# Altium project Multiplexer_SWD.PrjPCB (part 1 of 2)
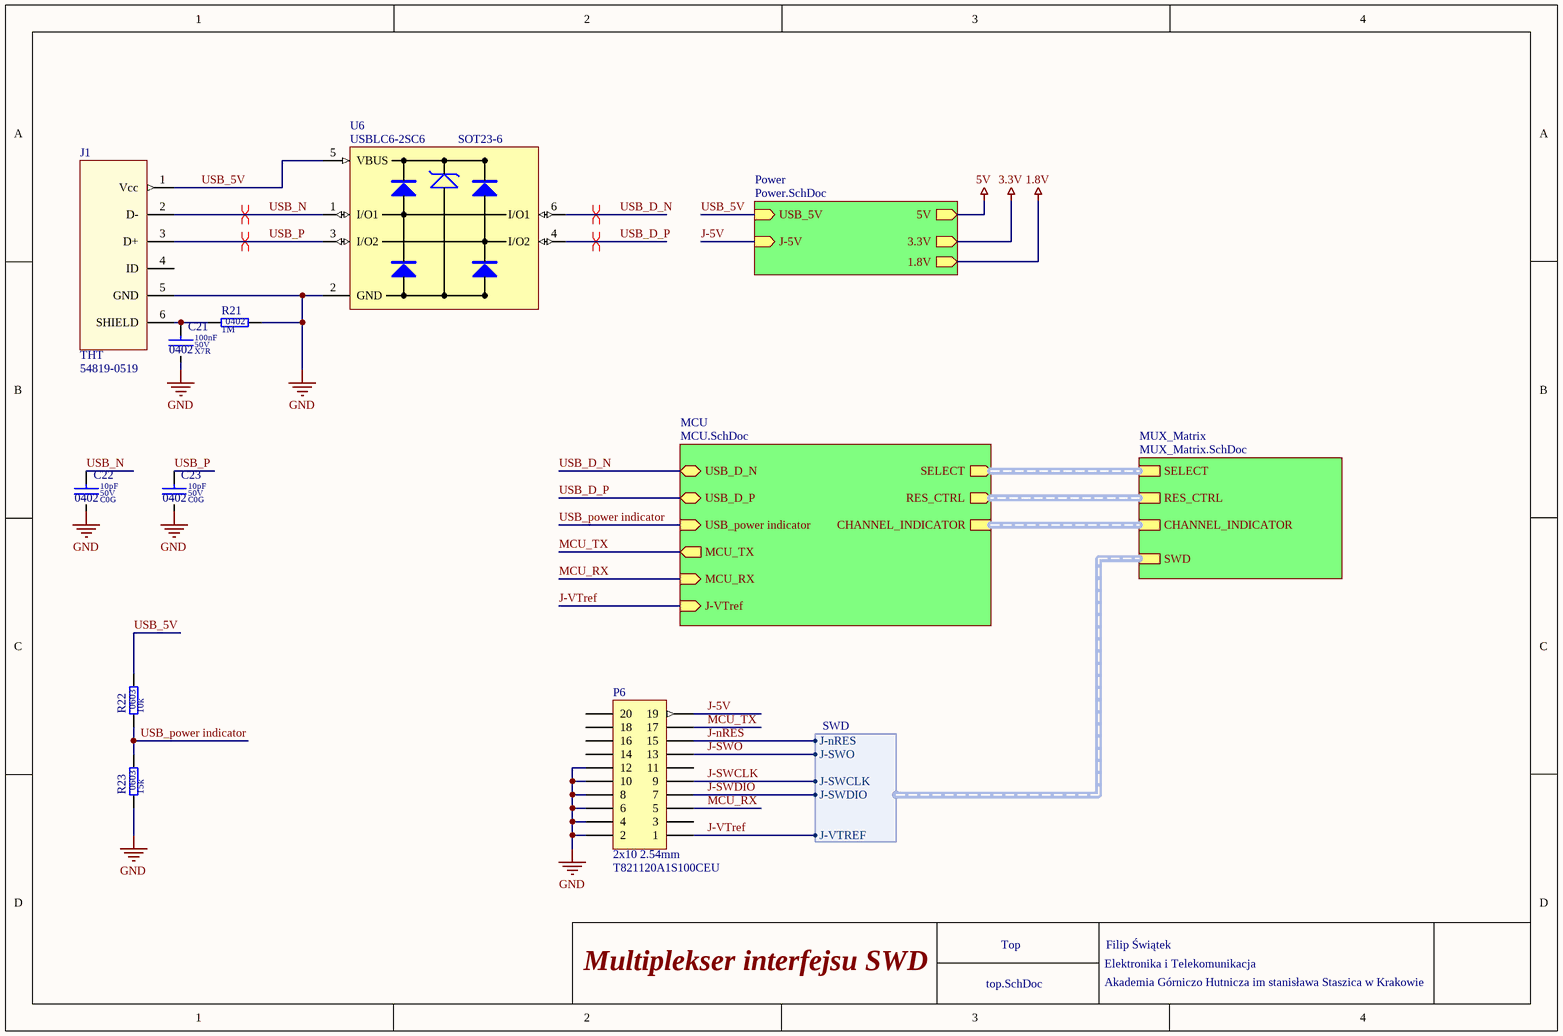
[diagram p0: top.SchDoc]
title: Multipkekser interfejsu SWD - Praca Inzynierska
7 sheets, 123 parts. Net scope: hierarchical (ports join the sheet entries above them; power ports are global).
Board file: PCB.PcbDoc
Sheets:
  top.SchDoc
    MCU = MCU.SchDoc
      U_TXS0102YZPR = TXS0102YZPR.SchDoc
      U_TXS0102YZPR = TXS0102YZPR.SchDoc
    MUX_Matrix = MUX_Matrix.SchDoc
      nRes_MUX = MUX.SchDoc
      SWO_MUX = MUX.SchDoc
      SWCLK_MUX = MUX.SchDoc
      SWDIO_MUX = MUX.SchDoc
      VTREF_MUX = MUX.SchDoc
      target_connectors_CH0 = target_connectors.SchDoc
      target_connectors_CH1 = target_connectors.SchDoc
      target_connectors_CH2 = target_connectors.SchDoc
      target_connectors_CH3 = target_connectors.SchDoc
      target_connectors_CH4 = target_connectors.SchDoc
      target_connectors_CH5 = target_connectors.SchDoc
      target_connectors_CH6 = target_connectors.SchDoc
      target_connectors_CH7 = target_connectors.SchDoc
    Power = Power.SchDoc

## Sheet top.SchDoc: Multiplekser interfejsu SWD
size A4; Module: Top; Organization: Altium Limited; Address1: L3, 12a Rodborough Rd; Adress2: Frenchs Forest; Address3: NSW; Address4: Australia 2086; SheetNumber: 1

### Parts
C21  value 100nF  Dielectric: X7R  Voltage: 50V  SCH_Footprint: 0402  [C_0402_1005]  (hidden comment: Ceramic X7R)
C22  value 10pF  Dielectric: C0G  Voltage: 50V  SCH_Footprint: 0402  [C_0402_1005]  (hidden comment: Ceramic C0G)
C23  value 10pF  Dielectric: C0G  Voltage: 50V  SCH_Footprint: 0402  [C_0402_1005]  (hidden comment: Ceramic C0G)
J1  value 54819-0519  SCH_Footprint: THT  [J_USB_MINIB_54819-0519_THT]  (hidden comment: USB connector)
P6  value T821120A1S100CEU  SCH_Footprint: 2x10 2.54mm  [P_IDC_2x10_2.54]  (hidden comment: 2x10 IDC 2.54mm shrouded)
R21  value 1M  SCH_Footprint: 0402  [R_0402_1005]  (hidden comment: Resistor)
R22  value 10k  SCH_Footprint: 0603  [R_0603_1608]  (hidden comment: Resistor)
R23  value 15k  SCH_Footprint: 0603  [R_0603_1608]  (hidden comment: Resistor)
U6  value USBLC6-2SC6  SCH_Footprint: SOT23-6  [SOT23-6_SC74A_SOT753]  (hidden comment: USB 2.0/1.1, Ethernet and SIM card ESD protection)

### Sub-sheets
MCU = MCU.SchDoc: USB_D_N (bidir), USB_D_P (bidir), USB_power indicator (in), SELECT (out, harness SELECT), MCU_TX (out), MCU_RX (in), J-VTref (in), RES_CTRL (out, harness RES_CTRL), CHANNEL_INDICATOR (harness CHANNEL_INDICATOR)
MUX_Matrix = MUX_Matrix.SchDoc: SWD (harness SWD), SELECT (harness SELECT), RES_CTRL (harness RES_CTRL), CHANNEL_INDICATOR (harness CHANNEL_INDICATOR)
Power = Power.SchDoc: J-5V (in), USB_5V (in), 5V (out), 3.3V (out), 1.8V (out)

### Harnesses
SWD: J-nRES, J-SWO, J-SWCLK, J-SWDIO, J-VTREF

### Nets
GND: C21.2 C22.2 C23.2 J1.5(GND) P6.2 P6.4 P6.6 P6.8 P6.10 P6.12 R21.2 R23.1 U6.2(GND)
J-5V: P6.19 ; sheet Power/J-5V
J-nRES: P6.15 ; sheet MUX_Matrix/SWD.J-nRES
J-SWCLK: P6.9 ; sheet MUX_Matrix/SWD.J-SWCLK
J-SWDIO: P6.7 ; sheet MUX_Matrix/SWD.J-SWDIO
J-SWO: P6.13 ; sheet MUX_Matrix/SWD.J-SWO
J-VTref: P6.1 ; sheet MCU/J-VTref, sheet MUX_Matrix/SWD.J-VTREF
MCU_RX: P6.5 ; sheet MCU/MCU_RX
MCU_TX: P6.17 ; sheet MCU/MCU_TX
USB_5V: J1.1(Vcc) R22.2 U6.5(VBUS) ; sheet Power/USB_5V
USB_D_N: U6.6(I/O1) ; sheet MCU/USB_D_N
USB_D_P: U6.4(I/O2) ; sheet MCU/USB_D_P
USB_N: C22.1 J1.2(D-) U6.1(I/O1)
USB_P: C23.1 J1.3(D+) U6.3(I/O2)
USB_power indicator: R22.1 R23.2 ; sheet MCU/USB_power indicator
NetC21_1: C21.1 J1.6(SHIELD) R21.1

Not connected (* = marked no-connect by the designer): J1 4(ID); P6 3 11 14 16 18 20

### Buses and harness runs
harness sheet MCU/CHANNEL_INDICATOR = sheet MUX_Matrix/CHANNEL_INDICATOR
harness sheet MCU/RES_CTRL = sheet MUX_Matrix/RES_CTRL
harness sheet MCU/SELECT = sheet MUX_Matrix/SELECT

### Layout directives
differential pair: USB_D_N, USB_D_P, USB_N, USB_P

### Notes on the sheet
- Elektronika i Telekomunikacja
- Akademia Górniczo Hutnicza im stanisława Staszica w Krakowie
- Filip Świątek

### Library data of the parts
C21 = C_100nF_50V_X7R_0402_10: Capacitor; Manufacturer: Murata; Manufacturer Part Number: GRM155R71H104KE14D; Tolerance (%): 10; Part Number: C_100nF_50V_X7R_0402_10; HelpURL: http://docs-europe.electrocomponents.com/webdocs/145f/0900766b8145f9d2.pdf; Supplier 1: TME; Supplier Part Number 1: GRM155R71H104KE14D; Supplier 2: RS Components; Supplier Part Number 2: 8847087; Supplier 3: Farnell; Supplier Part Number 3: 2611912; Supplier 4: Mouser; Supplier Part Number 4: 81-GRM155R71H104KE4D; Supplier 5: Digi-Key; Supplier Part Number 5: 490-10700-1-ND
C22 C23 = C_10pF_50V_C0G_0402_5: Capacitor; Manufacturer: Murata; Manufacturer Part Number: GRM1555C1H100JA01D; Tolerance (%): 5; Part Number: C_10pF_50V_C0G_0402_5; HelpURL: https://www.mouser.com/ds/2/281/c02e-2905.pdf; Supplier 1: TME; Supplier 2: RS Components; Supplier 3: Farnell; Supplier 4: Mouser; Supplier Part Number 4: 81-GRM1555C1H100JA1D; Supplier 5: Digi-Key
J1 = J_USB_MINIB_54819-0519: Złącze USB, Mini USB typu B, USB 2.0 OTG, Montaż przewlekany; Manufacturer: Molex; Part Number: J_USB_MINIB_54819-0519; Component Type: Standard; HelpURL: http://www.molex.com/pdm_docs/sd/548190519_sd.pdf; Manufacturer Part Number: 54819-0519; Supplier 1: TME; Supplier Part Number 1: MX-54819-0519; Supplier 2: RS Components; Supplier Part Number 2: 5152005P; Supplier 3: Farnell; Supplier Part Number 3: 9786465; Supplier 4: Mouser; Supplier Part Number 4: 538-54819-0519; Supplier 5: Digi-Key
P6 = P_IDC_2x10_2.54: Header, 20-Pin; Manufacturer: Amphenol; Part Number: P_IDC_2x10_2.54; Component Type: Standard; HelpURL: https://datasheet.octopart.com/T821120A1S100CEU-Amphenol-datasheet-12110023.pdf; Manufacturer Part Number: T821120A1S100CEU; Supplier 1: TME; Supplier Part Number 1: T821-1-20-S1; Supplier 2: RS Components; Supplier Part Number 2: 832-3499; Supplier 3: Farnell; Supplier Part Number 3: 2215309; Supplier 4: Mouser; Supplier 5: Digi-Key
R21 = R_1M_0402_1: Manufacturer: Vishay; Manufacturer Part Number: CRCW04021M00FKED; Voltage: 50V; Power: 200mW; Tolerance: 1%; Part Number: R_1M_0402_1; HelpURL: http://datasheet.octopart.com/CRCW04021M00FKED.-Vishay-datasheet-78776209.pdf; Supplier 1: TME; Supplier 2: RS Components; Supplier Part Number 2: 6788923; Supplier 3: Farnell; Supplier Part Number 3: 1469667; Supplier 4: Mouser; Supplier Part Number 4: 71-CRCW0402-1.0M-E3; Supplier 5: Digi-Key; Supplier Part Number 5: 541-1.00MLCT-ND
R22 = R_10k_0603_1: Manufacturer: Vishay; Manufacturer Part Number: CRCW060310K0FKTABC; Voltage: 75V; Power: 100mW; Tolerance: 1%; Part Number: R_10k_0603_1; HelpURL: http://www.tme.eu/pl/Document/622e28308c06d160637f2b14751ba16b/Data%20Sheet%20CRCW_BCe3.pdf; Supplier 1: TME; Supplier Part Number 1: CRCW060310K0FKTABC; Supplier 2: RS Components; Supplier 3: Farnell; Supplier 4: Mouser; Supplier Part Number 4: 667-ERJ-3EKF1002V; Supplier 5: Digi-Key; Supplier Part Number 5: P10KGCT-ND
R23 = R_15k_0603_1: Manufacturer: Yageo; Manufacturer Part Number: RC0603FR-0715KL; Voltage: 50V; Power: 100mW; Tolerance: 1%; Part Number: R_15k_0603_1; HelpURL: http://www.tme.eu/pl/Document/d2a72e545e5c8eb7bf2a04fa97535928/rc0603yageo.pdf; Supplier 1: TME; Supplier Part Number 1: RC0603FR-0715K; Supplier 2: RS Components; Supplier 3: Farnell; Supplier Part Number 3: 2413677; Supplier 4: Mouser; Supplier Part Number 4: 603-RC0603FR-0715KL; Supplier 5: Digi-Key; Supplier Part Number 5: 311-15.0KHRCT-ND
U6 = U_USBLC6-2SC6: Manufacturer: STMicroelectronics; Part Number: U_USBLC6-2SC6; HelpURL: https://www.st.com/resource/en/datasheet/usblc6-2.pdf; Manufacturer Part Number: USBLC6-2SC6; Supplier 1: TME; Supplier Part Number 1: USBLC6-2SC6; Supplier 2: RS Components; Supplier Part Number 2: 624-7693; Supplier 3: Farnell; Supplier Part Number 3: 2473979; Supplier 4: Mouser; Supplier Part Number 4: 511-USBLC6-2SC6; Supplier 5: Digi-Key; Supplier Part Number 5: 497-5235-1-ND

## Sheet MCU.SchDoc: Multiplekser interfejsu SWD
size A4; Organization: Altium Limited; Address1: L3, 12a Rodborough Rd; Adress2: Frenchs Forest; Address3: NSW; Address4: Australia 2086; SheetNumber: 2
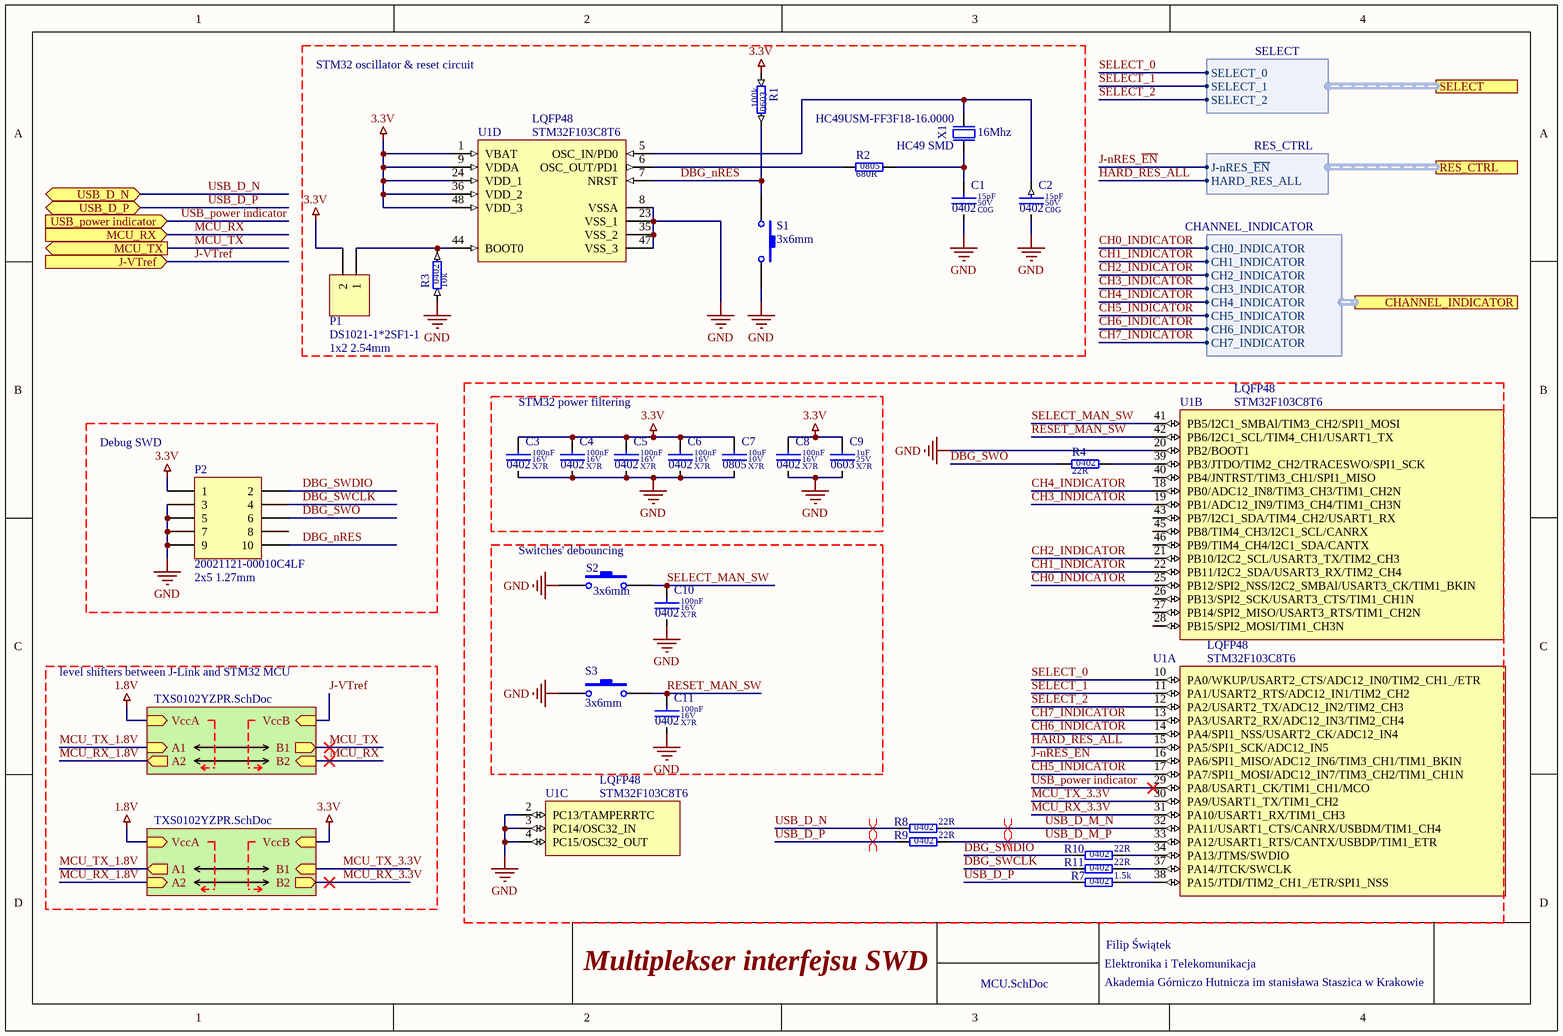
[diagram p1: MCU.SchDoc]

### Parts
C1  value 15pF  Dielectric: C0G  Voltage: 50V  SCH_Footprint: 0402  [C_0402_1005]  (hidden comment: Ceramic C0G)
C2  value 15pF  Dielectric: C0G  Voltage: 50V  SCH_Footprint: 0402  [C_0402_1005]  (hidden comment: Ceramic C0G)
C3  value 100nF  Dielectric: X7R  Voltage: 16V  SCH_Footprint: 0402  [C_0402_1005]  (hidden comment: Ceramic X7R)
C4  value 100nF  Dielectric: X7R  Voltage: 16V  SCH_Footprint: 0402  [C_0402_1005]  (hidden comment: Ceramic X7R)
C5  value 100nF  Dielectric: X7R  Voltage: 16V  SCH_Footprint: 0402  [C_0402_1005]  (hidden comment: Ceramic X7R)
C6  value 100nF  Dielectric: X7R  Voltage: 16V  SCH_Footprint: 0402  [C_0402_1005]  (hidden comment: Ceramic X7R)
C7  value 10uF  Dielectric: X7R  Voltage: 10V  SCH_Footprint: 0805  [C_0805_2012]  (hidden comment: Ceramic X7R)
C8  value 100nF  Dielectric: X7R  Voltage: 16V  SCH_Footprint: 0402  [C_0402_1005]  (hidden comment: Ceramic X7R)
C9  value 1uF  Dielectric: X7R  Voltage: 25V  SCH_Footprint: 0603  [C_0603_1608]  (hidden comment: Ceramic X7R)
C10  value 100nF  Dielectric: X7R  Voltage: 16V  SCH_Footprint: 0402  [C_0402_1005]  (hidden comment: Ceramic X7R)
C11  value 100nF  Dielectric: X7R  Voltage: 16V  SCH_Footprint: 0402  [C_0402_1005]  (hidden comment: Ceramic X7R)
P1  value DS1021-1*2SF1-1  SCH_Footprint: 1x2 2.54mm  [P_HEADER_1x2_2.54]  (hidden comment: Goldpin)
P2  value 20021121-00010C4LF  SCH_Footprint: 2x5 1.27mm  [P_HEADER_2x5_1.27]  (hidden comment: Jtag)
R1  value 100k  SCH_Footprint: 0603  [R_0603_1608]  (hidden comment: Resistor)
R2  value 680R  SCH_Footprint: 0805  [R_0805_2012]  (hidden comment: Resistor)
R3  value 10k  SCH_Footprint: 0402  [R_0402_1005]  (hidden comment: Resistor)
R4  value 22R  SCH_Footprint: 0402  [R_0402_1005]  (hidden comment: Resistor)
R7  value 1.5k  SCH_Footprint: 0402  [R_NC_0402_1005]  (hidden comment: Resistor)
R8  value 22R  SCH_Footprint: 0402  [R_0402_1005]  (hidden comment: Resistor)
R9  value 22R  SCH_Footprint: 0402  [R_0402_1005]  (hidden comment: Resistor)
R10  value 22R  SCH_Footprint: 0402  [R_0402_1005]  (hidden comment: Resistor)
R11  value 22R  SCH_Footprint: 0402  [R_0402_1005]  (hidden comment: Resistor)
S1  3x6mm  [S_TACTSWITCH3x6]
S2  3x6mm  [S_TACTSWITCH3x6]
S3  3x6mm  [S_TACTSWITCH3x6]
U1  SCH_Footprint: LQFP48  [LQFP48_7x7]  (hidden comment: STM32F103C8T6)  (parts A,B,C,D of 4)
X1  value 16Mhz  Manufacturer Part Number: HC49USM-FF3F18-16.0000  SCH_Footprint: HC49 SMD  [X_HC49_SMD]  (hidden comment: *)

### Blocks framed on the sheet
STM32 oscillator & reset circuit: C1 C2 P1 R1-R3 S1 U1 X1
STM32 power filtering: C3-C9
Debug SWD: P2
Switches' debouncing: C10 C11 S2 S3

### Sub-sheets
U_TXS0102YZPR = TXS0102YZPR.SchDoc: A1 (in), A2 (out), B1 (out), B2 (in), VccB (in), VccA (in)
U_TXS0102YZPR = TXS0102YZPR.SchDoc: A1 (out), A2 (in), B1 (in), B2 (out), VccB (in), VccA (in)

### Ports
CHANNEL_INDICATOR (harness CHANNEL_INDICATOR), J-VTref (in), MCU_RX (in), MCU_TX (out), RES_CTRL (harness RES_CTRL), SELECT (harness SELECT), USB_D_N (bidir), USB_D_P (bidir), USB_power indicator (in)

### Harnesses
SELECT: SELECT_0, SELECT_1, SELECT_2
RES_CTRL: HARD_RES_ALL, J-nRES_~{EN}
CHANNEL_INDICATOR: CH1_INDICATOR, CH2_INDICATOR, CH3_INDICATOR, CH4_INDICATOR, CH5_INDICATOR, CH6_INDICATOR, CH7_INDICATOR, CH0_INDICATOR

### Nets
1.8V: sheet U_TXS0102YZPR/VccA, sheet U_TXS0102YZPR/VccA
3.3V: C3.1 C4.1 C5.1 C6.1 C7.1 C8.1 C9.1 P1.2 P2.1 R1.1 U1.1(VBAT) U1.9(VDDA) U1.24(VDD_1) U1.36(VDD_2) U1.48(VDD_3) ; sheet U_TXS0102YZPR/VccB
GND: C1.2 C2.2 C3.2 C4.2 C5.2 C6.2 C7.2 C8.2 C9.2 C10.2 C11.2 P2.3 P2.5 P2.7 P2.9 R3.1 S1.2 S2.1 S3.1 U1.2(PC13/TAMPERRTC) U1.3(PC14/OSC32_IN) U1.4(PC15/OSC32_OUT) U1.8(VSSA) U1.20(PB2/BOOT1) U1.23(VSS_1) U1.35(VSS_2) U1.47(VSS_3)
CH0_INDICATOR: U1.25(PB12/SPI2_NSS/I2C2_SMBAl/USART3_CK/TIM1_BKIN) ; port CHANNEL_INDICATOR.CH0_INDICATOR
CH1_INDICATOR: U1.22(PB11/I2C2_SDA/USART3_RX/TIM2_CH4) ; port CHANNEL_INDICATOR.CH1_INDICATOR
CH2_INDICATOR: U1.21(PB10/I2C2_SCL/USART3_TX/TIM2_CH3) ; port CHANNEL_INDICATOR.CH2_INDICATOR
CH3_INDICATOR: U1.19(PB1/ADC12_IN9/TIM3_CH4/TIM1_CH3N) ; port CHANNEL_INDICATOR.CH3_INDICATOR
CH4_INDICATOR: U1.18(PB0/ADC12_IN8/TIM3_CH3/TIM1_CH2N) ; port CHANNEL_INDICATOR.CH4_INDICATOR
CH5_INDICATOR: U1.17(PA7/SPI1_MOSI/ADC12_IN7/TIM3_CH2/TIM1_CH1N) ; port CHANNEL_INDICATOR.CH5_INDICATOR
CH6_INDICATOR: U1.14(PA4/SPI1_NSS/USART2_CK/ADC12_IN4) ; port CHANNEL_INDICATOR.CH6_INDICATOR
CH7_INDICATOR: U1.13(PA3/USART2_RX/ADC12_IN3/TIM2_CH4) ; port CHANNEL_INDICATOR.CH7_INDICATOR
DBG_nRES: P2.10 R1.2 S1.1 U1.7(NRST)
DBG_SWCLK: P2.4 R11.1
DBG_SWDIO: P2.2 R10.1
DBG_SWO: P2.6 R4.1
HARD_RES_ALL: U1.15(PA5/SPI1_SCK/ADC12_IN5) ; port RES_CTRL.HARD_RES_ALL
J-nRES_~{EN}: U1.16(PA6/SPI1_MISO/ADC12_IN6/TIM3_CH1/TIM1_BKIN) ; port RES_CTRL.J-nRES_~{EN}
J-VTref: port J-VTref, sheet U_TXS0102YZPR/VccB
MCU_RX: port MCU_RX, sheet U_TXS0102YZPR/B2
MCU_RX_1.8V: sheet U_TXS0102YZPR/A2, sheet U_TXS0102YZPR/A2
MCU_RX_3.3V: U1.31(PA10/USART1_RX/TIM1_CH3) ; sheet U_TXS0102YZPR/B2
MCU_TX: port MCU_TX, sheet U_TXS0102YZPR/B1
MCU_TX_1.8V: sheet U_TXS0102YZPR/A1, sheet U_TXS0102YZPR/A1
MCU_TX_3.3V: U1.30(PA9/USART1_TX/TIM1_CH2) ; sheet U_TXS0102YZPR/B1
RESET_MAN_SW: C11.1 S3.2 U1.42(PB6/I2C1_SCL/TIM4_CH1/USART1_TX)
SELECT_0: U1.10(PA0/WKUP/USART2_CTS/ADC12_IN0/TIM2_CH1_/ETR) ; port SELECT.SELECT_0
SELECT_1: U1.11(PA1/USART2_RTS/ADC12_IN1/TIM2_CH2) ; port SELECT.SELECT_1
SELECT_2: U1.12(PA2/USART2_TX/ADC12_IN2/TIM2_CH3) ; port SELECT.SELECT_2
SELECT_MAN_SW: C10.1 S2.2 U1.41(PB5/I2C1_SMBAl/TIM3_CH2/SPI1_MOSI)
USB_D_M_N: R8.2 U1.32(PA11/USART1_CTS/CANRX/USBDM/TIM1_CH4)
USB_D_M_P: R9.2 U1.33(PA12/USART1_RTS/CANTX/USBDP/TIM1_ETR)
USB_D_N: R8.1 ; port USB_D_N
USB_D_P: R7.1 R9.1 ; port USB_D_P
USB_power indicator: U1.29(PA8/USART1_CK/TIM1_CH1/MCO) ; port USB_power indicator
NetC1_1: C1.1 R2.2 X1.1
NetC2_1: C2.1 U1.5(OSC_IN/PD0) X1.2
NetP1_1: P1.1 R3.2 U1.44(BOOT0)
NetR2_1: R2.1 U1.6(OSC_OUT/PD1)
NetR4_2: R4.2 U1.39(PB3/JTDO/TIM2_CH2/TRACESWO/SPI1_SCK)
NetR7_2: R7.2 U1.38(PA15/JTDI/TIM2_CH1_/ETR/SPI1_NSS)
NetR10_2: R10.2 U1.34(PA13/JTMS/SWDIO)
NetR11_2: R11.2 U1.37(PA14/JTCK/SWCLK)

Not connected (* = marked no-connect by the designer): P2 8; U1 26(PB13/SPI2_SCK/USART3_CTS/TIM1_CH1N) 27(PB14/SPI2_MISO/USART3_RTS/TIM1_CH2N) 28(PB15/SPI2_MOSI/TIM1_CH3N) 40(PB4/JNTRST/TIM3_CH1/SPI1_MISO) 43(PB7/I2C1_SDA/TIM4_CH2/USART1_RX) 45(PB8/TIM4_CH3/I2C1_SCL/CANRX) 46(PB9/TIM4_CH4/I2C1_SDA/CANTX)

### Layout directives
differential pair: USB_D_M_N, USB_D_M_P, USB_D_N, USB_D_P

### Notes on the sheet
- level shifters between J-Link and STM32 MCU
- Elektronika i Telekomunikacja
- Akademia Górniczo Hutnicza im stanisława Staszica w Krakowie
- Filip Świątek

### Library data of the parts
C1 C2 = C_15pF_50V_C0G_0402_5: Capacitor; Manufacturer: Murata; Manufacturer Part Number: GRM1555C1H150JA01D; Tolerance (%): 5; Part Number: C_15pF_50V_C0G_0402_5; HelpURL: http://www.tme.eu/en/Document/e3e731e59cc68b1ab6d46b158bb05733/MURATA_GRM.pdf; Supplier 1: TME; Supplier Part Number 1: GRM1555C1H150JA01D; Supplier 2: RS Components; Supplier Part Number 2: 7902758; Supplier 3: Farnell; Supplier Part Number 3: 2218840; Supplier 4: Mouser; Supplier Part Number 4: 81-GRM1555C1H150JA1D; Supplier 5: Digi-Key; Supplier Part Number 5: 490-5888-1-ND
C3-C6 C8 C10 C11 = C_100nF_16V_X7R_0402_10: Capacitor; Manufacturer: Murata; Manufacturer Part Number: GRM155R71C104KA88D; Tolerance (%): 10; Part Number: C_100nF_16V_X7R_0402_10; HelpURL: https://www.mouser.com/ds/2/281/c02e-2905.pdf; Supplier 1: TME; Supplier 2: RS Components; Supplier 3: Farnell; Supplier 4: Mouser; Supplier Part Number 4: 81-GRM155R71C104KA88; Supplier 5: Digi-Key
C7 = C_10uF_10V_X7R_0805_10: Capacitor; Manufacturer: Samsung Electro-Mechanics; Manufacturer Part Number: CL21B106KPQNNNG; Tolerance (%): 10; Part Number: C_10uF_10V_X7R_0805_10; HelpURL: http://www.tme.eu/pl/Document/4a42202b32dab16128fe107dd69598cc/samsung-chip-cap.pdf; Supplier 1: TME; Supplier Part Number 1: CL21B106KPQNNNG; Supplier 2: RS Components; Supplier 3: Farnell; Supplier 4: Mouser; Supplier 5: Digi-Key
C9 = C_1uF_25V_X7R_0603_10: Capacitor; Manufacturer: Samsung; Manufacturer Part Number: CL10B105KA8NNNC; Tolerance (%): 10; Part Number: C_1uF_25V_X7R_0603_10; HelpURL: http://www.tme.eu/pl/Document/4a42202b32dab16128fe107dd69598cc/samsung-chip-cap.pdf; Supplier 1: TME; Supplier Part Number 1: CL10B105KA8NNNC; Supplier 2: RS Components; Supplier 3: Farnell; Supplier 4: Mouser; Supplier 5: Digi-Key
P1 = P_HEADER_1x2_2.54: Header, 2-Pin; Manufacturer: Connfly; Part Number: P_HEADER_1x2_2.54; Component Type: Standard; HelpURL: http://www.tme.eu/en/Document/cc301e58a5da78cb543a94b5a5b7f06a/DS1021.pdf; Manufacturer Part Number: DS1021-1*2SF1-1; Supplier 1: TME; Supplier Part Number 1: ZL201-02G; Supplier 2: RS Components; Supplier 3: Farnell; Supplier 4: Mouser; Supplier 5: Digi-Key
P2 = P_HEADER_2x5_1.27: Header, 10-Pin, Dual row; Manufacturer: FCI; Part Number: P_HEADER_2x5_1.27; Component Type: Standard; HelpURL: http://www.mouser.com/catalog/645/usd/1591.pdf; Manufacturer Part Number: 20021121-00010C4LF; Supplier 1: TME; Supplier Part Number 1: 20021121-00010C4LF; Supplier 2: RS Components; Supplier Part Number 2: 794-4584; Supplier 3: Farnell; Supplier Part Number 3: 1865279; Supplier 4: Mouser; Supplier Part Number 4: 649-202112100010C4LF; Supplier 5: Digi-Key; Supplier Part Number 5: 609-3695-1-ND
R1 = R_100k_0603_1: Manufacturer: Royalohm; Manufacturer Part Number: 0603SAF1003T5E; Voltage: 50V; Power: 100mW; Tolerance: 1%; Part Number: R_100k_0603_1; HelpURL: http://www.tme.eu/pl/Document/b315665a56acbc42df513c99b390ad98/ROYALOHM-THICKFILM.pdf; Supplier 1: TME; Supplier Part Number 1: SMD0603-100K-1%; Supplier 2: RS Components; Supplier 3: Farnell; Supplier 4: Mouser; Supplier Part Number 4: 667-ERJ-3EKF1003V; Supplier 5: Digi-Key; Supplier Part Number 5: P100KHCT-ND
R2 = R_680R_0805_1: Manufacturer: Royalohm; Manufacturer Part Number: HP05W3F6800T5E; Voltage: 150V; Power: 300mW; Tolerance: 1%; Part Number: R_680R_0805_1; HelpURL: https://www.tme.eu/pl/Document/fa390a0a31e891a154d3713216995c6e/HighPowerHP.pdf; Supplier 1: TME; Supplier Part Number 1: HP05-680R1%; Supplier 2: RS Components; Supplier 3: Farnell; Supplier 4: Mouser; Supplier 5: Digi-Key
R3 = R_10k_0402_1: Manufacturer: Yageo; Manufacturer Part Number: RC0402FR-0710KL; Voltage: 50V; Power: 63mW; Tolerance: 1%; Part Number: R_10k_0402_1; HelpURL: http://www.tme.eu/pl/Document/1a2bc76e2be68b3b1670068306778ce6/rc0402yageo.pdf; Supplier 1: TME; Supplier Part Number 1: RC0402FR-0710K; Supplier 2: RS Components; Supplier 3: Farnell; Supplier 4: Mouser; Supplier 5: Digi-Key
R4 R8-R11 = R_22R_0402_1: Manufacturer: Panasonic; Manufacturer Part Number: ERJ-2RKF22R0X; Voltage: 50V; Power: 63mW; Tolerance: 1%; Part Number: R_22R_0402_1; HelpURL: http://datasheet.octopart.com/ERJ2RKF22R0X-Panasonic-datasheet-13266541.pdf; Supplier 1: TME; Supplier 2: RS Components; Supplier Part Number 2: 7325390; Supplier 3: Farnell; Supplier Part Number 3: 2302453; Supplier 4: Mouser; Supplier Part Number 4: 667-ERJ-2RKF22R0X; Supplier 5: Digi-Key; Supplier Part Number 5: P22.0LCT-ND
R7 = R_GENERIC_0402: Part Number: R_GENERIC_0402; Supplier 1: TME; Supplier 2: RS Components; Supplier 3: Farnell; Supplier 4: Mouser; Supplier 5: Digi-Key
S1-S3 = S_TACTSWITCH: Tact Switch; Manufacturer: Ninigi; Manufacturer Part Number: TACTM-34N-F; Part Number: S_TACTSWITCH; SCH_Footprint: 3x6mm; HelpURL: http://pl.ninigi.com/product/tactm-34n-f/pdf; Supplier 1: TME; Supplier Part Number 1: TACTM-34N-F; Supplier 2: RS Components; Supplier 3: Farnell; Supplier 4: Mouser; Supplier 5: Digi-Key
U1 = UP_STM32F103C8T6: Manufacturer: STMicroelectronics; Value: STM32F103C8T6; Part Number: UP_STM32F103C8T6; HelpURL: https://datasheet.octopart.com/STM32F103C8T6-STMicroelectronics-datasheet-48026265.pdf; Manufacturer Part Number: STM32F103C8T6; Supplier 1: TME; Supplier Part Number 1: STM32F103C8T6; Supplier 2: RS Components; Supplier Part Number 2: 1023545; Supplier 3: Farnell; Supplier Part Number 3: 1447637; Supplier 4: Mouser; Supplier Part Number 4: 511-STM32F103C8T6; Supplier 5: Digi-Key; Supplier Part Number 5: 497-6063-ND
X1 = X_HC49USM-FF3F16.00: Resonator Ceramic; Manufacturer: Ilsi; Part Number: X_HC49USM-FF3F16.00; HelpURL: http://www.tme.eu/pl/Document/f9d1782f27c3a96ae8c4e91c94d19ebc/HC49USM_Series.pdf; Supplier 1: TME; Supplier Part Number 1: HC49USM-FF3F16.00; Supplier 2: RS Components; Supplier 3: Farnell; Supplier 4: Mouser; Supplier 5: Digi-Key

## Sheet TXS0102YZPR.SchDoc: Multipkekser interfejsu SWD - Praca Inzynierska
size A4
Used 2 times, as channels MCU/U_TXS0102YZPR, MCU/U_TXS0102YZPR. Parts and nets are listed once, with the designators drawn on the sheet.
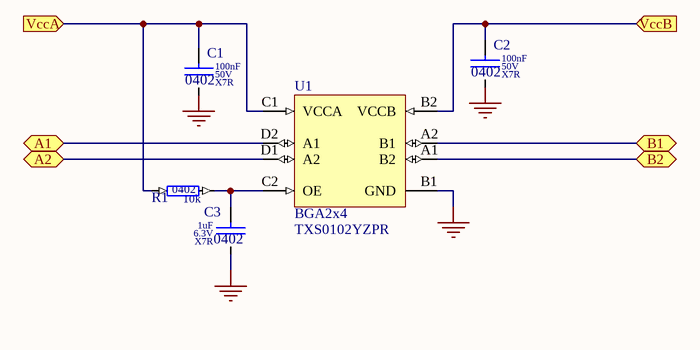
[diagram p2: TXS0102YZPR.SchDoc]

### Parts
C1  value 100nF  Dielectric: X7R  Voltage: 50V  SCH_Footprint: 0402  [C_0402_1005]  (hidden comment: Ceramic X7R)
C2  value 100nF  Dielectric: X7R  Voltage: 50V  SCH_Footprint: 0402  [C_0402_1005]  (hidden comment: Ceramic X7R)
C3  value 1uF  Dielectric: X7R  Voltage: 6.3V  SCH_Footprint: 0402  [C_0402_1005]  (hidden comment: Ceramic X7R)
R1  value 10k  SCH_Footprint: 0402  [R_0402_1005]  (hidden comment: Resistor)
U1  value TXS0102YZPR  SCH_Footprint: BGA2x4  [BGA_2x4x0.5mm]  (hidden comment: Level shifter)

### Ports
A1 (bidir), A2 (bidir), B1 (bidir), B2 (bidir), VccA (in), VccB (in)

### Nets
GND: C1.2 C2.2 C3.2 U1.B1(GND)
A1: U1.D2(A1) ; port A1
A2: U1.D1(A2) ; port A2
B1: U1.A2(B1) ; port B1
B2: U1.A1(B2) ; port B2
VccA: C1.1 R1.1 U1.C1(VCCA) ; port VccA
VccB: C2.1 U1.B2(VCCB) ; port VccB
NetC3_1: C3.1 R1.2 U1.C2(OE)

### Channels
MCU/U_TXS0102YZPR: designators end in _MCU_U_TXS0102YZPR#1; ports A1=MCU_TX_1.8V A2=MCU_RX_1.8V B1=MCU_TX B2=MCU_RX VccA=1.8V VccB=J-VTref
MCU/U_TXS0102YZPR: designators end in _MCU_U_TXS0102YZPR#2; ports A1=MCU_TX_1.8V A2=MCU_RX_1.8V B1=MCU_TX_3.3V B2=MCU_RX_3.3V VccA=1.8V VccB=3.3V

### Notes on the sheet
- Title:
- Sheet:
- of
- Author:
- Model:
- Document Number:
- Checked by:
- Iss-Rev:
- Approved by:
- Date:
- File name:

### Library data of the parts
C1 C2 = C_100nF_50V_X7R_0402_10: as C21 on sheet top; Part Number: C_100nF_50V_X7R_0402_10; HelpURL: http://docs-europe.electrocomponents.com/webdocs/145f/0900766b8145f9d2.pdf; Supplier 1: TME; Supplier Part Number 1: GRM155R71H104KE14D; Supplier 2: RS Components; Supplier Part Number 2: 8847087; Supplier 3: Farnell; Supplier Part Number 3: 2611912; Supplier 4: Mouser; Supplier Part Number 4: 81-GRM155R71H104KE4D; Supplier 5: Digi-Key; Supplier Part Number 5: 490-10700-1-ND
C3 = C_1uF_6.3V_X7R_0402_10: Capacitor; Manufacturer: Murata; Manufacturer Part Number: GRM155R70J105KA12D; Tolerance (%): 10; Part Number: C_1uF_6.3V_X7R_0402_10; HelpURL: https://www.mouser.com/ds/2/281/c02e-2905.pdf; Supplier 1: TME; Supplier 2: RS Components; Supplier 3: Farnell; Supplier 4: Mouser; Supplier Part Number 4: 81-GRM155R70J105KA2D; Supplier 5: Digi-Key
R1 = R_10k_0402_1: as R3 on sheet MCU; Part Number: R_10k_0402_1; HelpURL: http://www.tme.eu/pl/Document/1a2bc76e2be68b3b1670068306778ce6/rc0402yageo.pdf; Supplier 1: TME; Supplier Part Number 1: RC0402FR-0710K; Supplier 2: RS Components; Supplier 3: Farnell; Supplier 4: Mouser; Supplier 5: Digi-Key
U1 = U_TXS0102YZPR: Manufacturer: Texas Instruments; Part Number: U_TXS0102YZPR; HelpURL: http://www.ti.com/lit/ds/symlink/txs0102.pdf; Manufacturer Part Number: TXS0102YZPR; Supplier 1: TME; Supplier 2: RS Components; Supplier Part Number 2: 8175650P; Supplier 3: Farnell; Supplier Part Number 3: 2335616; Supplier 4: Mouser; Supplier Part Number 4: 595-TXS0102YZPR; Supplier 5: Digi-Key; Supplier Part Number 5: 296-21932-1-ND

## Sheet MUX_Matrix.SchDoc: Multiplekser interfejsu SWD
size A3; Organization: Altium Limited; Address1: L3, 12a Rodborough Rd; Adress2: Frenchs Forest; Address3: NSW; Address4: Australia 2086; SheetNumber: 4
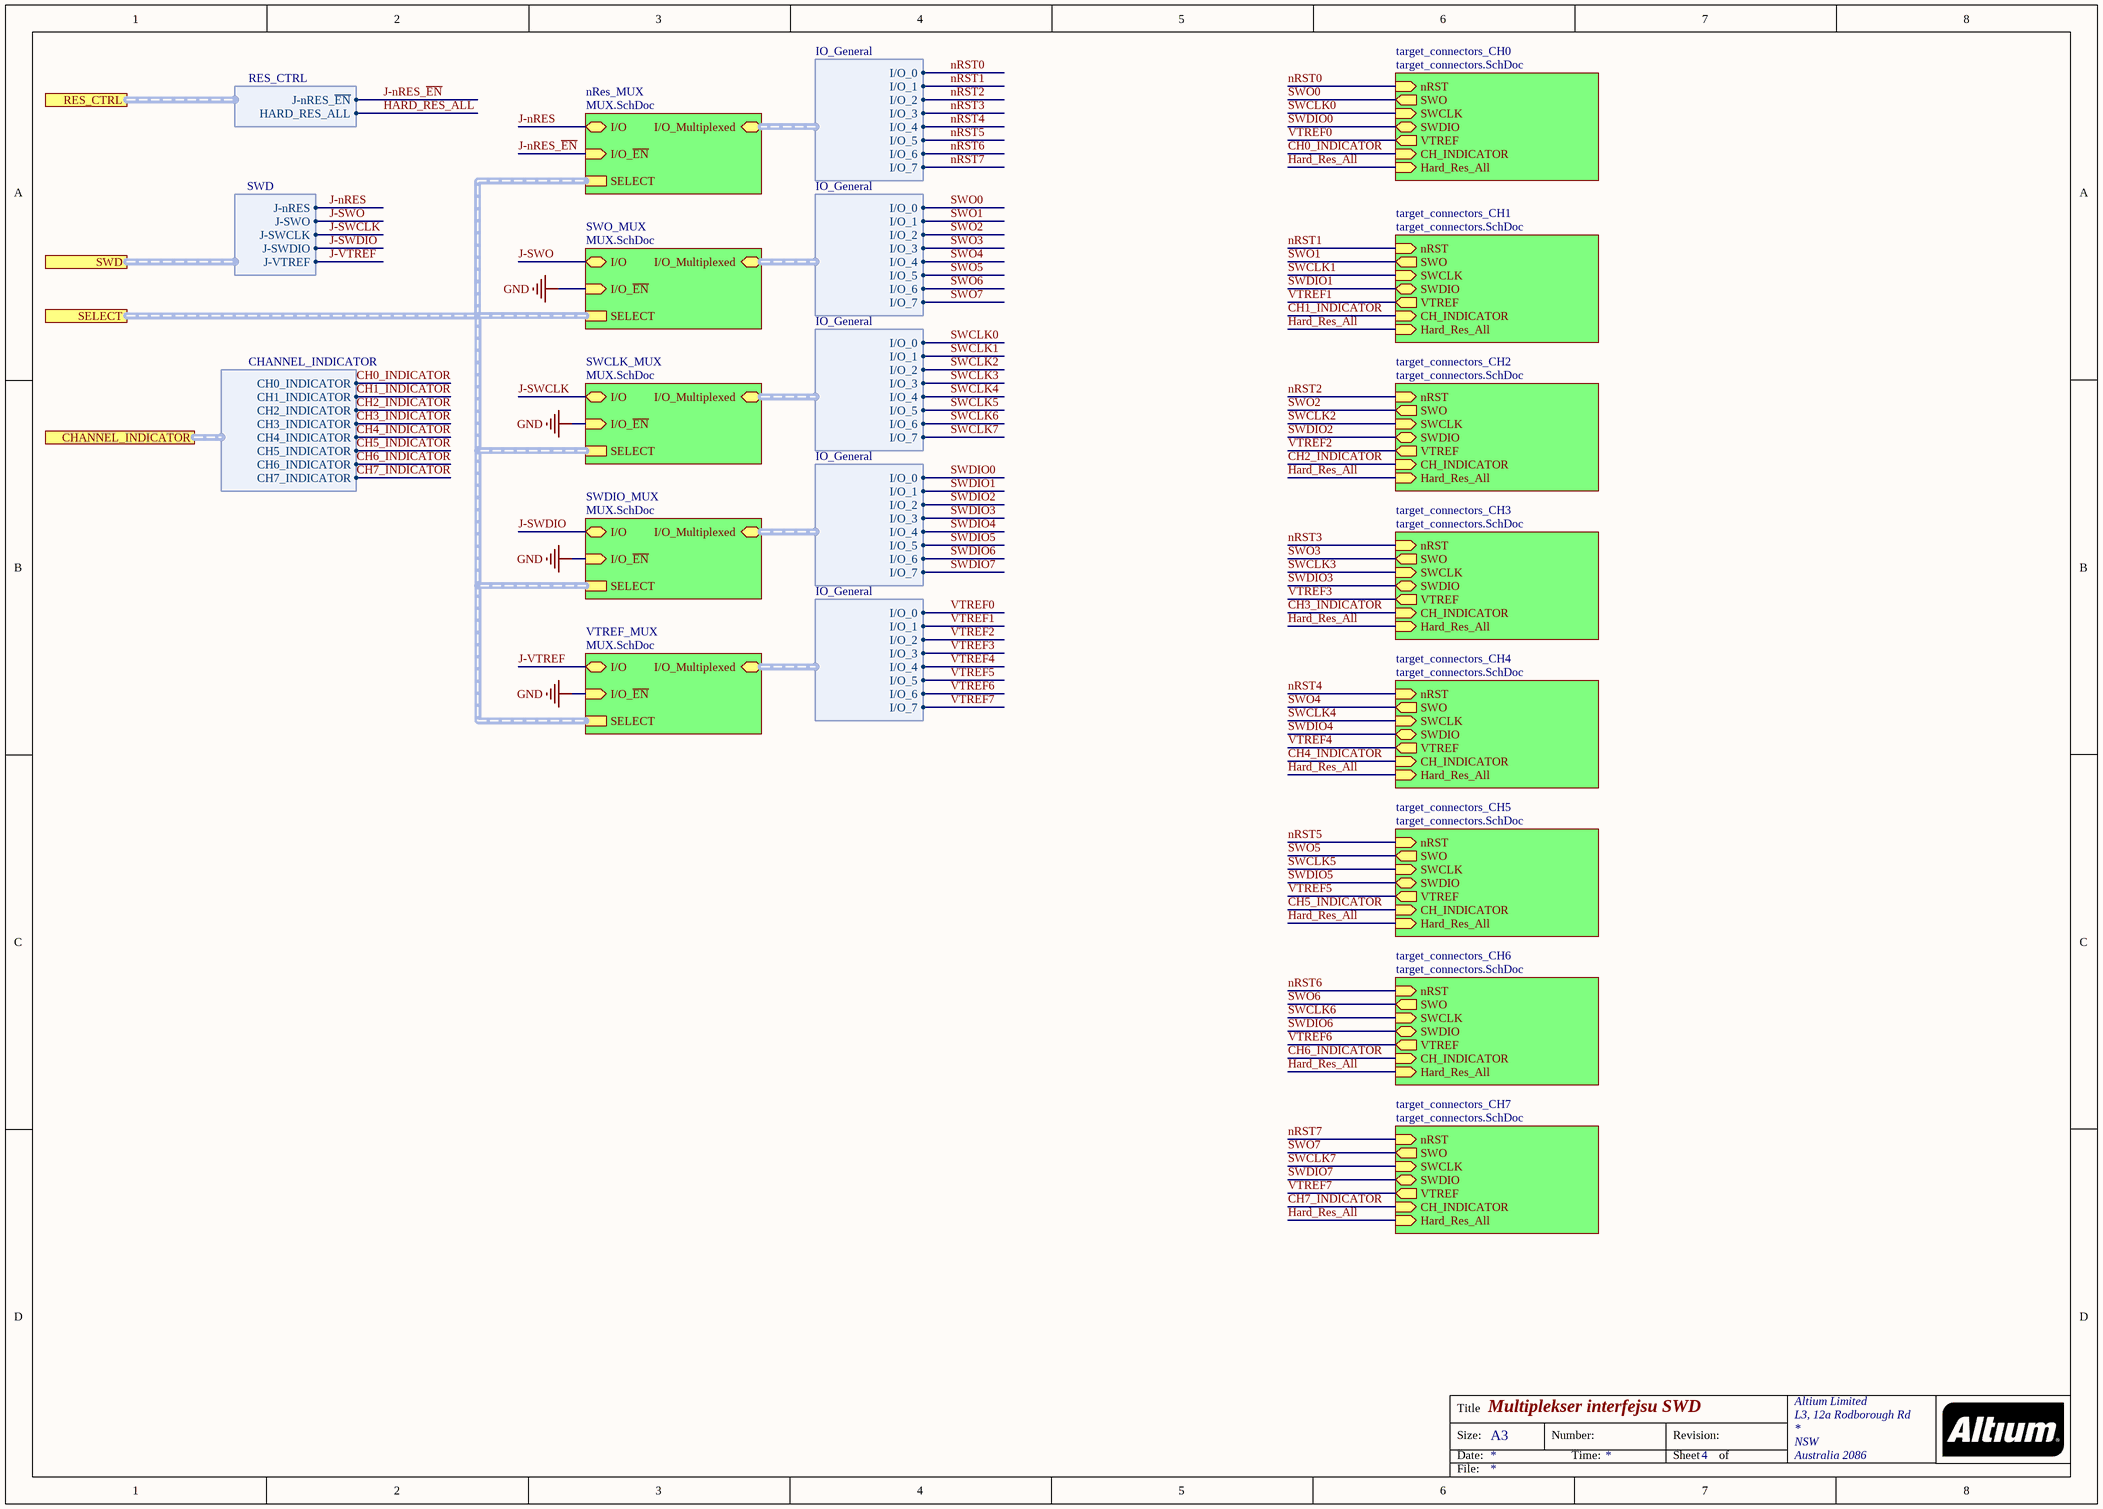
[diagram p3: MUX_Matrix.SchDoc]

### Sub-sheets
nRes_MUX = MUX.SchDoc: I/O (bidir), I/O_Multiplexed (bidir, harness IO_General), I/O_~{EN} (in), SELECT (harness SELECT)
SWCLK_MUX = MUX.SchDoc: I/O (bidir), I/O_Multiplexed (bidir, harness IO_General), SELECT (harness SELECT), I/O_~{EN} (in)
SWDIO_MUX = MUX.SchDoc: I/O (bidir), I/O_Multiplexed (bidir, harness IO_General), SELECT (harness SELECT), I/O_~{EN} (in)
SWO_MUX = MUX.SchDoc: I/O (bidir), I/O_Multiplexed (bidir, harness IO_General), SELECT (harness SELECT), I/O_~{EN} (in)
target_connectors_CH0 = target_connectors.SchDoc: nRST (in), SWO (out), SWCLK (in), SWDIO (bidir), VTREF (out), CH_INDICATOR (in), Hard_Res_All (in)
target_connectors_CH1 = target_connectors.SchDoc: nRST (in), SWO (out), SWCLK (in), SWDIO (bidir), VTREF (out), CH_INDICATOR (in), Hard_Res_All (in)
target_connectors_CH2 = target_connectors.SchDoc: nRST (in), SWO (out), SWCLK (in), SWDIO (bidir), VTREF (out), CH_INDICATOR (in), Hard_Res_All (in)
target_connectors_CH3 = target_connectors.SchDoc: nRST (in), SWO (out), SWCLK (in), SWDIO (bidir), VTREF (out), CH_INDICATOR (in), Hard_Res_All (in)
target_connectors_CH4 = target_connectors.SchDoc: nRST (in), SWO (out), SWCLK (in), SWDIO (bidir), VTREF (out), CH_INDICATOR (in), Hard_Res_All (in)
target_connectors_CH5 = target_connectors.SchDoc: nRST (in), SWO (out), SWCLK (in), SWDIO (bidir), VTREF (out), CH_INDICATOR (in), Hard_Res_All (in)
target_connectors_CH6 = target_connectors.SchDoc: nRST (in), SWO (out), SWCLK (in), SWDIO (bidir), VTREF (out), CH_INDICATOR (in), Hard_Res_All (in)
target_connectors_CH7 = target_connectors.SchDoc: nRST (in), SWO (out), SWCLK (in), SWDIO (bidir), VTREF (out), CH_INDICATOR (in), Hard_Res_All (in)
VTREF_MUX = MUX.SchDoc: I/O (bidir), I/O_Multiplexed (bidir, harness IO_General), SELECT (harness SELECT), I/O_~{EN} (in)

### Ports
CHANNEL_INDICATOR (harness CHANNEL_INDICATOR), RES_CTRL (harness RES_CTRL), SELECT (harness SELECT), SWD (harness SWD)

### Harnesses
SWD: J-nRES, J-SWO, J-SWCLK, J-SWDIO, J-VTREF
IO_General: I/O_0, I/O_1, I/O_2, I/O_3, I/O_5, I/O_6, I/O_7, I/O_4
RES_CTRL: HARD_RES_ALL, J-nRES_~{EN}
CHANNEL_INDICATOR: CH1_INDICATOR, CH2_INDICATOR, CH3_INDICATOR, CH4_INDICATOR, CH5_INDICATOR, CH6_INDICATOR, CH7_INDICATOR, CH0_INDICATOR

### Nets
GND: sheet SWO_MUX/I/O_~{EN}, sheet SWCLK_MUX/I/O_~{EN}, sheet SWDIO_MUX/I/O_~{EN}, sheet VTREF_MUX/I/O_~{EN}
CH0_INDICATOR: sheet target_connectors_CH0/CH_INDICATOR, port CHANNEL_INDICATOR.CH0_INDICATOR
CH1_INDICATOR: sheet target_connectors_CH1/CH_INDICATOR, port CHANNEL_INDICATOR.CH1_INDICATOR
CH2_INDICATOR: sheet target_connectors_CH2/CH_INDICATOR, port CHANNEL_INDICATOR.CH2_INDICATOR
CH3_INDICATOR: sheet target_connectors_CH3/CH_INDICATOR, port CHANNEL_INDICATOR.CH3_INDICATOR
CH4_INDICATOR: sheet target_connectors_CH4/CH_INDICATOR, port CHANNEL_INDICATOR.CH4_INDICATOR
CH5_INDICATOR: sheet target_connectors_CH5/CH_INDICATOR, port CHANNEL_INDICATOR.CH5_INDICATOR
CH6_INDICATOR: sheet target_connectors_CH6/CH_INDICATOR, port CHANNEL_INDICATOR.CH6_INDICATOR
CH7_INDICATOR: sheet target_connectors_CH7/CH_INDICATOR, port CHANNEL_INDICATOR.CH7_INDICATOR
HARD_RES_ALL: sheet target_connectors_CH0/Hard_Res_All, sheet target_connectors_CH1/Hard_Res_All, sheet target_connectors_CH2/Hard_Res_All, sheet target_connectors_CH3/Hard_Res_All, sheet target_connectors_CH4/Hard_Res_All, sheet target_connectors_CH5/Hard_Res_All, sheet target_connectors_CH6/Hard_Res_All, sheet target_connectors_CH7/Hard_Res_All, port RES_CTRL.HARD_RES_ALL
J-nRES: sheet nRes_MUX/I/O, port SWD.J-nRES
J-nRES_~{EN}: sheet nRes_MUX/I/O_~{EN}, port RES_CTRL.J-nRES_~{EN}
J-SWCLK: sheet SWCLK_MUX/I/O, port SWD.J-SWCLK
J-SWDIO: sheet SWDIO_MUX/I/O, port SWD.J-SWDIO
J-SWO: sheet SWO_MUX/I/O, port SWD.J-SWO
J-VTref: sheet VTREF_MUX/I/O, port SWD.J-VTREF
nRST0: sheet target_connectors_CH0/nRST, sheet nRes_MUX/I/O_Multiplexed.I/O_0
nRST1: sheet target_connectors_CH1/nRST, sheet nRes_MUX/I/O_Multiplexed.I/O_1
nRST2: sheet target_connectors_CH2/nRST, sheet nRes_MUX/I/O_Multiplexed.I/O_2
nRST3: sheet target_connectors_CH3/nRST, sheet nRes_MUX/I/O_Multiplexed.I/O_3
nRST4: sheet target_connectors_CH4/nRST, sheet nRes_MUX/I/O_Multiplexed.I/O_4
nRST5: sheet target_connectors_CH5/nRST, sheet nRes_MUX/I/O_Multiplexed.I/O_5
nRST6: sheet target_connectors_CH6/nRST, sheet nRes_MUX/I/O_Multiplexed.I/O_6
nRST7: sheet target_connectors_CH7/nRST, sheet nRes_MUX/I/O_Multiplexed.I/O_7
SWCLK0: sheet target_connectors_CH0/SWCLK, sheet SWCLK_MUX/I/O_Multiplexed.I/O_0
SWCLK1: sheet target_connectors_CH1/SWCLK, sheet SWCLK_MUX/I/O_Multiplexed.I/O_1
SWCLK2: sheet target_connectors_CH2/SWCLK, sheet SWCLK_MUX/I/O_Multiplexed.I/O_2
SWCLK3: sheet target_connectors_CH3/SWCLK, sheet SWCLK_MUX/I/O_Multiplexed.I/O_3
SWCLK4: sheet target_connectors_CH4/SWCLK, sheet SWCLK_MUX/I/O_Multiplexed.I/O_4
SWCLK5: sheet target_connectors_CH5/SWCLK, sheet SWCLK_MUX/I/O_Multiplexed.I/O_5
SWCLK6: sheet target_connectors_CH6/SWCLK, sheet SWCLK_MUX/I/O_Multiplexed.I/O_6
SWCLK7: sheet target_connectors_CH7/SWCLK, sheet SWCLK_MUX/I/O_Multiplexed.I/O_7
SWDIO0: sheet target_connectors_CH0/SWDIO, sheet SWDIO_MUX/I/O_Multiplexed.I/O_0
SWDIO1: sheet target_connectors_CH1/SWDIO, sheet SWDIO_MUX/I/O_Multiplexed.I/O_1
SWDIO2: sheet target_connectors_CH2/SWDIO, sheet SWDIO_MUX/I/O_Multiplexed.I/O_2
SWDIO3: sheet target_connectors_CH3/SWDIO, sheet SWDIO_MUX/I/O_Multiplexed.I/O_3
SWDIO4: sheet target_connectors_CH4/SWDIO, sheet SWDIO_MUX/I/O_Multiplexed.I/O_4
SWDIO5: sheet target_connectors_CH5/SWDIO, sheet SWDIO_MUX/I/O_Multiplexed.I/O_5
SWDIO6: sheet target_connectors_CH6/SWDIO, sheet SWDIO_MUX/I/O_Multiplexed.I/O_6
SWDIO7: sheet target_connectors_CH7/SWDIO, sheet SWDIO_MUX/I/O_Multiplexed.I/O_7
SWO0: sheet target_connectors_CH0/SWO, sheet SWO_MUX/I/O_Multiplexed.I/O_0
SWO1: sheet target_connectors_CH1/SWO, sheet SWO_MUX/I/O_Multiplexed.I/O_1
SWO2: sheet target_connectors_CH2/SWO, sheet SWO_MUX/I/O_Multiplexed.I/O_2
SWO3: sheet target_connectors_CH3/SWO, sheet SWO_MUX/I/O_Multiplexed.I/O_3
SWO4: sheet target_connectors_CH4/SWO, sheet SWO_MUX/I/O_Multiplexed.I/O_4
SWO5: sheet target_connectors_CH5/SWO, sheet SWO_MUX/I/O_Multiplexed.I/O_5
SWO6: sheet target_connectors_CH6/SWO, sheet SWO_MUX/I/O_Multiplexed.I/O_6
SWO7: sheet target_connectors_CH7/SWO, sheet SWO_MUX/I/O_Multiplexed.I/O_7
VTREF0: sheet target_connectors_CH0/VTREF, sheet VTREF_MUX/I/O_Multiplexed.I/O_0
VTREF1: sheet target_connectors_CH1/VTREF, sheet VTREF_MUX/I/O_Multiplexed.I/O_1
VTREF2: sheet target_connectors_CH2/VTREF, sheet VTREF_MUX/I/O_Multiplexed.I/O_2
VTREF3: sheet target_connectors_CH3/VTREF, sheet VTREF_MUX/I/O_Multiplexed.I/O_3
VTREF4: sheet target_connectors_CH4/VTREF, sheet VTREF_MUX/I/O_Multiplexed.I/O_4
VTREF5: sheet target_connectors_CH5/VTREF, sheet VTREF_MUX/I/O_Multiplexed.I/O_5
VTREF6: sheet target_connectors_CH6/VTREF, sheet VTREF_MUX/I/O_Multiplexed.I/O_6
VTREF7: sheet target_connectors_CH7/VTREF, sheet VTREF_MUX/I/O_Multiplexed.I/O_7

### Buses and harness runs
harness port SELECT = sheet nRes_MUX/SELECT = sheet SWCLK_MUX/SELECT = sheet SWDIO_MUX/SELECT = sheet SWO_MUX/SELECT = sheet VTREF_MUX/SELECT

### Notes on the sheet
- Title
- Size:
- Date:
- A3
- Number:
- Time:
- Revision:
- Sheet
- of
- File:

## Sheet MUX.SchDoc: Multiplekser interfejsu SWD
size A4; Organization: Altium Limited; Address1: L3, 12a Rodborough Rd; Adress2: Frenchs Forest; Address3: NSW; Address4: Australia 2086; SheetNumber: 6
Used 5 times, as channels MUX_Matrix/nRes_MUX, MUX_Matrix/SWO_MUX, MUX_Matrix/SWCLK_MUX, MUX_Matrix/SWDIO_MUX, MUX_Matrix/VTREF_MUX. Parts and nets are listed once, with the designators drawn on the sheet.
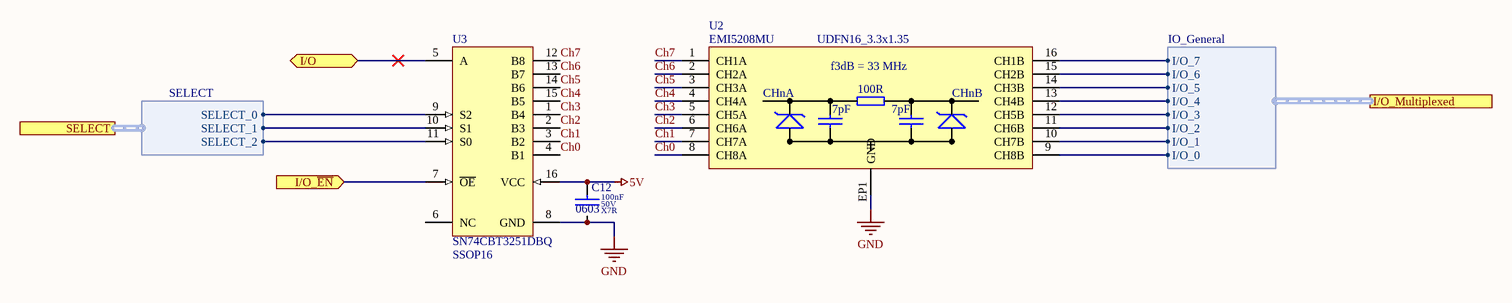
[diagram p4: MUX.SchDoc]

### Parts
C12  value 100nF  Dielectric: X7R  Voltage: 50V  SCH_Footprint: 0603  [C_0603_1608]  (hidden comment: Ceramic X7R)
U2  value EMI5208MU  [UDFN16_3.3x1.35]  (hidden comment: 8- channel ESD protector 5V + Lo-pas filter)
U3  value SN74CBT3251DBQ  SCH_Footprint: SSOP16  [SSOP16_4.9x3.9]  (hidden comment: 1-of-8 FET Multiplexer and Demultiplexer)

### Ports
I/O (bidir), I/O_Multiplexed (harness IO_General), I/O_~{EN} (in), SELECT (harness SELECT)

### Harnesses
IO_General: I/O_0, I/O_1, I/O_2, I/O_3, I/O_5, I/O_6, I/O_7, I/O_4
SELECT: SELECT_0, SELECT_1, SELECT_2

### Nets
5V: C12.1 U3.16(VCC)
GND: C12.2 U2.EP1(GND) U3.8(GND)
Ch0: U2.8(CH8A) U3.4(B1)
Ch1: U2.7(CH7A) U3.3(B2)
Ch2: U2.6(CH6A) U3.2(B3)
Ch3: U2.5(CH5A) U3.1(B4)
Ch4: U2.4(CH4A) U3.15(B5)
Ch5: U2.3(CH3A) U3.14(B6)
Ch6: U2.2(CH2A) U3.13(B7)
Ch7: U2.1(CH1A) U3.12(B8)
I/O: U3.5(A) ; port I/O
I/O_~{EN}: U3.7(~{OE}) ; port I/O_~{EN}
NetU2_9: U2.9(CH8B) ; port I/O_Multiplexed.I/O_0
NetU2_10: U2.10(CH7B) ; port I/O_Multiplexed.I/O_1
NetU2_11: U2.11(CH6B) ; port I/O_Multiplexed.I/O_2
NetU2_12: U2.12(CH5B) ; port I/O_Multiplexed.I/O_3
NetU2_13: U2.13(CH4B) ; port I/O_Multiplexed.I/O_4
NetU2_14: U2.14(CH3B) ; port I/O_Multiplexed.I/O_5
NetU2_15: U2.15(CH2B) ; port I/O_Multiplexed.I/O_6
NetU2_16: U2.16(CH1B) ; port I/O_Multiplexed.I/O_7
NetU3_9: U3.9(S2) ; port SELECT.SELECT_0
NetU3_10: U3.10(S1) ; port SELECT.SELECT_1
NetU3_11: U3.11(S0) ; port SELECT.SELECT_2

Not connected (* = marked no-connect by the designer): U3 6(NC)

### Channels
MUX_Matrix/nRes_MUX: designators end in _nRes_MUX; ports I/O=J-nRES I/O_~{EN}=J-nRES_~{EN}
MUX_Matrix/SWO_MUX: designators end in _SWO_MUX; ports I/O=J-SWO I/O_~{EN}=GND
MUX_Matrix/SWCLK_MUX: designators end in _SWCLK_MUX; ports I/O=J-SWCLK I/O_~{EN}=GND
MUX_Matrix/SWDIO_MUX: designators end in _SWDIO_MUX; ports I/O=J-SWDIO I/O_~{EN}=GND
MUX_Matrix/VTREF_MUX: designators end in _VTREF_MUX; ports I/O=J-VTref I/O_~{EN}=GND

### Notes on the sheet
- Elektronika i Telekomunikacja
- Akademia Górniczo Hutnicza im stanisława Staszica w Krakowie
- Filip Świątek
- (in symbol U_EMI5208MU) f3dB = 33 MHz; 100R; CHnA; CHnB; 7pF

### Library data of the parts
C12 = C_100nF_50V_X7R_0603_5: Capacitor; Manufacturer: Samsung; Manufacturer Part Number: CL10B104JB8NNNC; Tolerance (%): 5; Part Number: C_100nF_50V_X7R_0603_5; HelpURL: http://www.tme.eu/pl/Document/4a42202b32dab16128fe107dd69598cc/samsung-chip-cap.pdf; Supplier 1: TME; Supplier Part Number 1: CL10B104JB8NNNC; Supplier 2: RS Components; Supplier 3: Farnell; Supplier 4: Mouser; Supplier 5: Digi-Key
U2 = U_EMI5208MU: 8 - channel esd-protection + lo-pass filter; Manufacturer: ON Semiconductor; SCH_Footprint: UDFN16_3.3x1.35; Part Number: U_EMI5208MU; HelpURL: https://www.onsemi.com/pub/Collateral/EMI5204MU-D.PDF; Manufacturer Part Number: EMI5208MU; Supplier 1: TME; Supplier 2: RS Components; Supplier 3: Farnell; Supplier Part Number 3: 2844908; Supplier 4: Mouser; Supplier Part Number 4: 863-EMI5208MUTAG; Supplier 5: Digi-Key; Supplier Part Number 5: EMI5208MUTAGOSCT-ND
U3 = U_SN74CBT3251DBQ: Manufacturer: Texas Instruments; Part Number: U_SN74CBT3251DBQ; HelpURL: http://www.ti.com/lit/gpn/sn74cbt3251; Manufacturer Part Number: SN74CBT3251DBQ; Supplier 1: TME; Supplier 2: RS Components; Supplier 3: Farnell; Supplier 4: Mouser; Supplier Part Number 4: 595-SN74CBT3251DBQR; Supplier 5: Digi-Key; Supplier Part Number 5: 296-6429-2-ND

## Sheet target_connectors.SchDoc: Multipkekser interfejsu SWD - Praca Inzynierska
size A4; SheetNumber: 3
Used 8 times, as channels MUX_Matrix/target_connectors_CH0, MUX_Matrix/target_connectors_CH1, MUX_Matrix/target_connectors_CH2, MUX_Matrix/target_connectors_CH3, MUX_Matrix/target_connectors_CH4, MUX_Matrix/target_connectors_CH5, MUX_Matrix/target_connectors_CH6, MUX_Matrix/target_connectors_CH7. Parts and nets are listed once, with the designators drawn on the sheet.
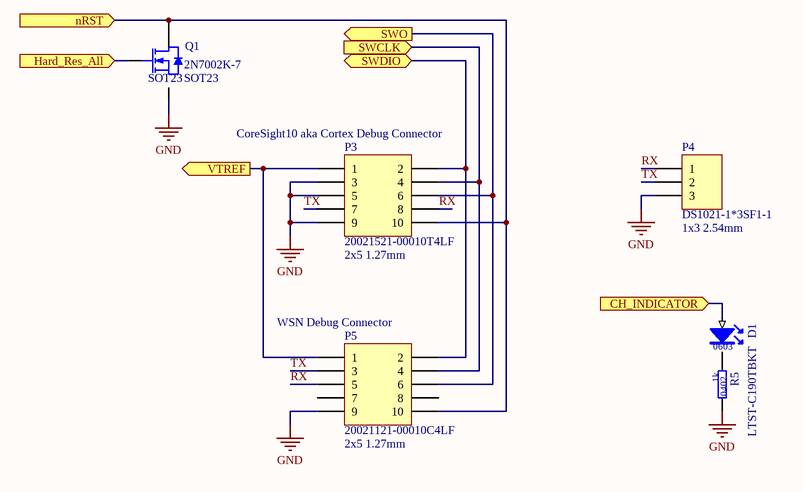
[diagram p5: target_connectors.SchDoc]

### Parts
D1  value LTST-C190TBKT  SCH_Footprint: 0603  [OL_0603_1608]  (hidden comment: Blue Led)
P3  value 20021521-00010T4LF  SCH_Footprint: 2x5 1.27mm  [P_IDC_2x5_1.27]  (hidden comment: IDC 1.27 2x5)
P4  value DS1021-1*3SF1-1  SCH_Footprint: 1x3 2.54mm  [P_HEADER_1x3_2.54]  (hidden comment: Goldpin)
P5  value 20021121-00010C4LF  SCH_Footprint: 2x5 1.27mm  [P_HEADER_2x5_1.27]  (hidden comment: Jtag)
Q1  SCH_Footprint: SOT23  [SOT23_TO236_SC59]  (hidden comment: 2N7002K-7)
R5  value 1k  SCH_Footprint: 0402  [R_0402_1005]  (hidden comment: Resistor)

### Ports
CH_INDICATOR (in), Hard_Res_All (in), nRST (in), SWCLK (in), SWDIO (bidir), SWO (out), VTREF (out)

### Nets
GND: P3.3 P3.5 P3.9 P4.3 P5.9 Q1.2(S) R5.2
CH_INDICATOR: D1.2(A) ; port CH_INDICATOR
Hard_Res_All: Q1.1(G) ; port Hard_Res_All
nRST: P3.10 P5.10 Q1.3(D) ; port nRST
RX: P3.8 P4.1 P5.5
SWCLK: P3.4 P5.4 ; port SWCLK
SWDIO: P3.2 P5.2 ; port SWDIO
SWO: P3.6 P5.6 ; port SWO
TX: P3.7 P4.2 P5.3
VTREF: P3.1 P5.1 ; port VTREF
NetD1_1: D1.1(K) R5.1

Not connected (* = marked no-connect by the designer): P5 7 8

### Channels
MUX_Matrix/target_connectors_CH0: designators end in _target_connectors_CH0; ports CH_INDICATOR=CH0_INDICATOR Hard_Res_All=HARD_RES_ALL nRST=nRST0 SWCLK=SWCLK0 SWDIO=SWDIO0 SWO=SWO0 VTREF=VTREF0
MUX_Matrix/target_connectors_CH1: designators end in _target_connectors_CH1; ports CH_INDICATOR=CH1_INDICATOR Hard_Res_All=HARD_RES_ALL nRST=nRST1 SWCLK=SWCLK1 SWDIO=SWDIO1 SWO=SWO1 VTREF=VTREF1
MUX_Matrix/target_connectors_CH2: designators end in _target_connectors_CH2; ports CH_INDICATOR=CH2_INDICATOR Hard_Res_All=HARD_RES_ALL nRST=nRST2 SWCLK=SWCLK2 SWDIO=SWDIO2 SWO=SWO2 VTREF=VTREF2
MUX_Matrix/target_connectors_CH3: designators end in _target_connectors_CH3; ports CH_INDICATOR=CH3_INDICATOR Hard_Res_All=HARD_RES_ALL nRST=nRST3 SWCLK=SWCLK3 SWDIO=SWDIO3 SWO=SWO3 VTREF=VTREF3
MUX_Matrix/target_connectors_CH4: designators end in _target_connectors_CH4; ports CH_INDICATOR=CH4_INDICATOR Hard_Res_All=HARD_RES_ALL nRST=nRST4 SWCLK=SWCLK4 SWDIO=SWDIO4 SWO=SWO4 VTREF=VTREF4
MUX_Matrix/target_connectors_CH5: designators end in _target_connectors_CH5; ports CH_INDICATOR=CH5_INDICATOR Hard_Res_All=HARD_RES_ALL nRST=nRST5 SWCLK=SWCLK5 SWDIO=SWDIO5 SWO=SWO5 VTREF=VTREF5
MUX_Matrix/target_connectors_CH6: designators end in _target_connectors_CH6; ports CH_INDICATOR=CH6_INDICATOR Hard_Res_All=HARD_RES_ALL nRST=nRST6 SWCLK=SWCLK6 SWDIO=SWDIO6 SWO=SWO6 VTREF=VTREF6
MUX_Matrix/target_connectors_CH7: designators end in _target_connectors_CH7; ports CH_INDICATOR=CH7_INDICATOR Hard_Res_All=HARD_RES_ALL nRST=nRST7 SWCLK=SWCLK7 SWDIO=SWDIO7 SWO=SWO7 VTREF=VTREF7

### Notes on the sheet
- (near P3) CoreSight10 aka Cortex Debug Connector
- (near P5) WSN Debug Connector

### Library data of the parts
D1 = OL_B_0603: LED_BLUE; Manufacturer: Lite-On; Part Number: OL_B_0603; HelpURL: https://datasheet.octopart.com/LTST-C190TBKT-Lite-On-datasheet-158557.pdf; Manufacturer Part Number: LTST-C190TBKT; Supplier 1: TME; Supplier Part Number 1: LTST-C190TBKT; Supplier 2: RS Components; Supplier Part Number 2: 6920994P; Supplier 3: Farnell; Supplier 4: Mouser; Supplier Part Number 4: 859-LTST-C190TBKT; Supplier 5: Digi-Key; Supplier Part Number 5: 160-1646-1-ND
P3 = P_IDC_2x5_1.27: Header, 10-Pin, Dual row; Manufacturer: Amphenol; Part Number: P_IDC_2x5_1.27; Component Type: Standard; HelpURL: https://cdn.amphenol-icc.com/media/wysiwyg/files/drawing/20021521.pdf; Manufacturer Part Number: 20021521-00010T4LF; Supplier 1: TME; Supplier 2: RS Components; Supplier 3: Farnell; Supplier 4: Mouser; Supplier Part Number 4: 649-221521-00010T4LF; Supplier 5: Digi-Key; Supplier Part Number 5: 609-6534-ND
P4 = P_HEADER_1x3_2.54: Header, 3-Pin; Manufacturer: Connfly; Part Number: P_HEADER_1x3_2.54; Component Type: Standard; HelpURL: http://www.tme.eu/en/Document/cc301e58a5da78cb543a94b5a5b7f06a/DS1021.pdf; Manufacturer Part Number: DS1021-1*3SF1-1; Supplier 1: TME; Supplier Part Number 1: ZL201-03G; Supplier 2: RS Components; Supplier 3: Farnell; Supplier 4: Mouser; Supplier 5: Digi-Key
P5 = P_HEADER_2x5_1.27: as P2 on sheet MCU; Part Number: P_HEADER_2x5_1.27; Component Type: Standard; HelpURL: http://www.mouser.com/catalog/645/usd/1591.pdf; Manufacturer Part Number: 20021121-00010C4LF; Supplier 1: TME; Supplier Part Number 1: 20021121-00010C4LF; Supplier 2: RS Components; Supplier Part Number 2: 794-4584; Supplier 3: Farnell; Supplier Part Number 3: 1865279; Supplier 4: Mouser; Supplier Part Number 4: 649-202112100010C4LF; Supplier 5: Digi-Key; Supplier Part Number 5: 609-3695-1-ND
Q1 = QN_2N7002K-7_60V_350mA: Manufacturer: DIODES inc; Type: N-MOS; Voltage: 60V; Current: 0A8; Part Number: QN_2N7002K-7_60V_350mA; Value: 2N7002K-7; HelpURL: http://datasheet.octopart.com/2N7002K-7-Diodes-Inc.-datasheet-12515815.pdf; Manufacturer Part Number: 2N7002K-7; Supplier 1: TME; Supplier 2: RS Components; Supplier Part Number 2: 7703383; Supplier 3: Farnell; Supplier Part Number 3: 1713825; Supplier 4: Mouser; Supplier Part Number 4: 621-2N7002K-7; Supplier 5: Digi-Key; Supplier Part Number 5: 2N7002K-7DICT-ND
R5 = R_1k_0402_1: Manufacturer: Yageo; Manufacturer Part Number: RC0402FR-071K; Voltage: 50V; Power: 63mW; Tolerance: 1%; Part Number: R_1k_0402_1; HelpURL: http://www.tme.eu/pl/Document/1a2bc76e2be68b3b1670068306778ce6/rc0402yageo.pdf; Supplier 1: TME; Supplier Part Number 1: RC0402FR-071K; Supplier 2: RS Components; Supplier 3: Farnell; Supplier Part Number 3: 9239235; Supplier 4: Mouser; Supplier Part Number 4: 603-RC0402FR-071KP; Supplier 5: Digi-Key; Supplier Part Number 5: 311-1.00KLRCT-ND

## Sheet Power.SchDoc: Multiplekser interfejsu SWD
size A4; Organization: Altium Limited; Address1: L3, 12a Rodborough Rd; Adress2: Frenchs Forest; Address3: NSW; Address4: Australia 2086; SheetNumber: 5
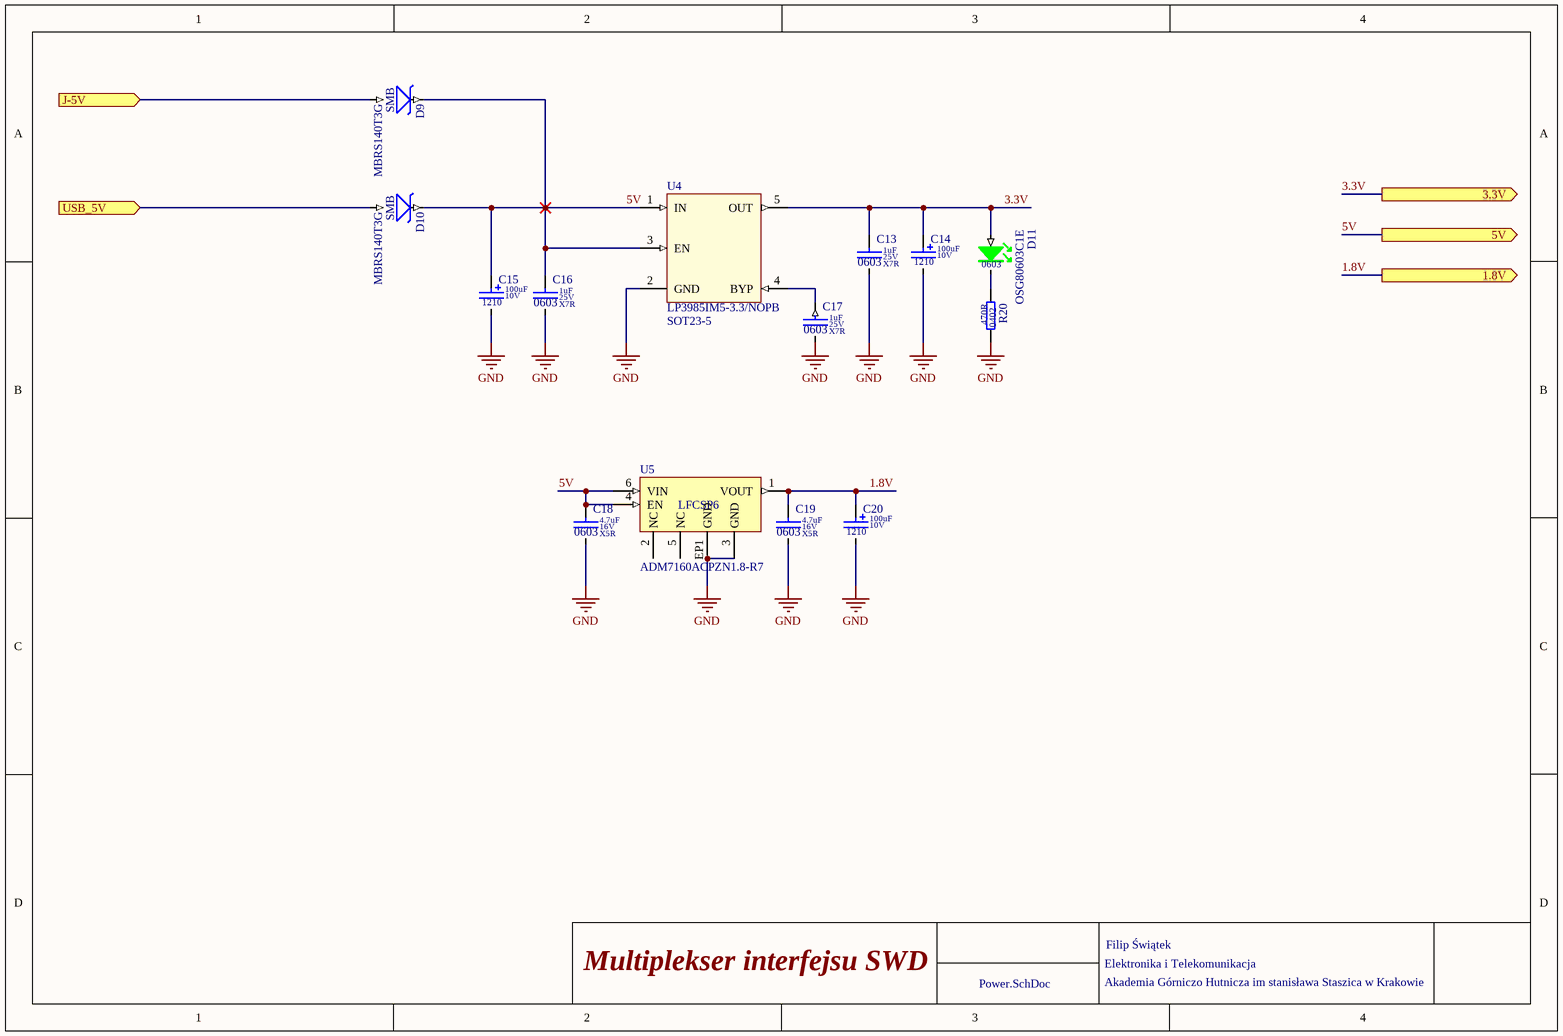
[diagram p6: Power.SchDoc]

### Parts
C13  value 1uF  Dielectric: X7R  Voltage: 25V  SCH_Footprint: 0603  [C_0603_1608]  (hidden comment: Ceramic X7R)
C14  value 100uF  SCH_Footprint: 1210  Voltage: 10V  [CT_1210_3225]  (hidden comment: Tantalum Capacitor)
C15  value 100uF  SCH_Footprint: 1210  Voltage: 10V  [CT_1210_3225]  (hidden comment: Tantalum Capacitor)
C16  value 1uF  Dielectric: X7R  Voltage: 25V  SCH_Footprint: 0603  [C_0603_1608]  (hidden comment: Ceramic X7R)
C17  value 1uF  Dielectric: X7R  Voltage: 25V  SCH_Footprint: 0603  [C_0603_1608]  (hidden comment: Ceramic X7R)
C18  value 4.7uF  Dielectric: X5R  Voltage: 16V  SCH_Footprint: 0603  [C_0603_1608]  (hidden comment: Ceramic X5R)
C19  value 4.7uF  Dielectric: X5R  Voltage: 16V  SCH_Footprint: 0603  [C_0603_1608]  (hidden comment: Ceramic X5R)
C20  value 100uF  SCH_Footprint: 1210  Voltage: 10V  [CT_1210_3225]  (hidden comment: Tantalum Capacitor)
D9  SCH_Footprint: SMB  [SMB_DO-214AA]  (hidden comment: MBRS140T3G)
D10  SCH_Footprint: SMB  [SMB_DO-214AA]  (hidden comment: MBRS140T3G)
D11  value OSG80603C1E  SCH_Footprint: 0603  [OL_0603_1608]  (hidden comment: Green led)
R20  value 470R  SCH_Footprint: 0402  [R_0402_1005]  (hidden comment: Resistor)
U4  value LP3985IM5-3.3/NOPB  SCH_Footprint: SOT23-5  [SOT23-5_SC74A_SOT753_M]  (hidden comment: LP3985IM5-3.3)
U5  value ADM7160ACPZN1.8-R7  SCH_Footprint: LFCSP6  [LFCSP-6-3]  (hidden comment: ADM7160ACPZN1.8-R2)

### Ports
1.8V (out), 3.3V (out), 5V (out), J-5V (in), USB_5V (in)

### Nets
1.8V: C19.1 C20.1 U5.1(VOUT) ; port 1.8V
3.3V: C13.1 C14.1 D11.2(A) U4.5(OUT) ; port 3.3V
5V: C15.1 C16.1 C18.1 D9.1 D10.1 U4.1(IN) U4.3(EN) U5.4(EN) U5.6(VIN) ; port 5V
GND: C13.2 C14.2 C15.2 C16.2 C17.2 C18.2 C19.2 C20.2 R20.2 U4.2(GND) U5.3(GND) U5.EP1(GND)
J-5V: D9.2 ; port J-5V
USB_5V: D10.2 ; port USB_5V
NetC17_1: C17.1 U4.4(BYP)
NetD11_1: D11.1(K) R20.1

Not connected (* = marked no-connect by the designer): U5 2(NC) 5(NC)

### Notes on the sheet
- Elektronika i Telekomunikacja
- Akademia Górniczo Hutnicza im stanisława Staszica w Krakowie
- Filip Świątek

### Library data of the parts
C13 C16 C17 = C_1uF_25V_X7R_0603_10: as C9 on sheet MCU; Part Number: C_1uF_25V_X7R_0603_10; HelpURL: http://www.tme.eu/pl/Document/4a42202b32dab16128fe107dd69598cc/samsung-chip-cap.pdf; Supplier 1: TME; Supplier Part Number 1: CL10B105KA8NNNC; Supplier 2: RS Components; Supplier 3: Farnell; Supplier 4: Mouser; Supplier 5: Digi-Key
C14 C15 C20 = CT_100uF_10V_TA2O5_1210_20: Capacitor; Manufacturer: AVX; Manufacturer Part Number: TAJB107M010RNJ; Dielectric: TA2O5; Tolerance (%): 20; Part Number: CT_100uF_10V_TA2O5_1210_20; HelpURL: https://datasheet.octopart.com/TAJB107M010RNJ-AVX-datasheet-12511273.pdf; Supplier 1: TME; Supplier Part Number 1: TAJB107M010R; Supplier 2: RS Components; Supplier Part Number 2: 1360118; Supplier 3: Farnell; Supplier Part Number 3: 1658150; Supplier 4: Mouser; Supplier Part Number 4: 581-TAJB107M010R; Supplier 5: Digi-Key; Supplier Part Number 5: 478-5801-1-ND
C18 C19 = C_4.7uF_16V_X5R_0603_10: Capacitor; Manufacturer: Murata; Manufacturer Part Number: GRM188R61C475KAAJD; Tolerance (%): 10; Part Number: C_4.7uF_16V_X5R_0603_10; HelpURL: https://datasheet.octopart.com/GRM188R61C475KAAJD-Murata-datasheet-66077093.pdf; Supplier 1: TME; Supplier 2: RS Components; Supplier Part Number 2: 884-7264P; Supplier 3: Farnell; Supplier Part Number 3: 2611924; Supplier 4: Mouser; Supplier Part Number 4: 81-GRM188R61C475KAJD; Supplier 5: Digi-Key; Supplier Part Number 5: 490-10481-2-ND
D9 D10 = DS_MBRS140T3G_1A_40V_SMB: Manufacturer: ON Semiconductor; Voltage: 40V; Current: 1A; Value: MBRS140T3G; Part Number: DS_MBRS140T3G_1A_40V_SMB; Manufacturer Part Number: MBRS140T3G; Supplier 1: TME; Supplier 2: RS Components; Supplier 3: Farnell; Supplier 4: Mouser; Supplier 5: Digi-Key; Supplier Part Number 5: MBRS140T3GOSCT-ND
D11 = OL_G_0603_OSG80603C1E: LED GREEN; Manufacturer: Optosupply; Part Number: OL_G_0603_OSG80603C1E; Manufacturer Part Number: OSG80603C1E; Supplier 1: TME; Supplier Part Number 1: OSG80603C1E; Supplier 2: RS Components; Supplier 3: Farnell; Supplier 4: Mouser; Supplier 5: Digi-Key
R20 = R_470R_0402_1: Manufacturer: Yageo; Manufacturer Part Number: RC0402FR-07470RL; Voltage: 50V; Power: 63mW; Tolerance: 1%; Part Number: R_470R_0402_1; HelpURL: http://datasheet.octopart.com/RC0402FR-07470RL-Yageo-datasheet-10408619.pdf; Supplier 1: TME; Supplier Part Number 1: RC0402FR-07470R; Supplier 2: RS Components; Supplier 3: Farnell; Supplier Part Number 3: 9239197; Supplier 4: Mouser; Supplier Part Number 4: 603-RC0402FR-07470RL; Supplier 5: Digi-Key; Supplier Part Number 5: 311-470LRCT-ND
U4 = VL_LP3985IM5-3.3: Manufacturer: Texas Instruments; Voltage: 3V3; Current: 0A15; Part Number: VL_LP3985IM5-3.3; HelpURL: http://www.ti.com/lit/ds/symlink/lp3985.pdf; Manufacturer Part Number: LP3985IM5-3.3/NOPB; Supplier 1: TME; Supplier Part Number 1: LP3985IM5-3.3; Supplier 2: RS Components; Supplier Part Number 2: 102-5736; Supplier 3: Farnell; Supplier Part Number 3: 1469025; Supplier 4: Mouser; Supplier Part Number 4: 926-3985IM5-3.3/NOPB; Supplier 5: Digi-Key; Supplier Part Number 5: LP3985IM5-3.3/NOPBCT-ND
U5 = VL_ADM7160ACPZN1.8-R7: Manufacturer: Analog Devices; Voltage: 1V8; Current: 0A2; Part Number: VL_ADM7160ACPZN1.8-R7; HelpURL: http://datasheet.octopart.com/ADM7160ACPZN1.8-R2-Analog-Devices-datasheet-26822004.pdf; Manufacturer Part Number: ADM7160ACPZN1.8-R7; Supplier 1: TME; Supplier 2: RS Components; Supplier 3: Farnell; Supplier 4: Mouser; Supplier Part Number 4: 584-DM7160ACPZN1.8R7; Supplier 5: Digi-Key; Supplier Part Number 5: ADM7160ACPZN1.8-R7CT-ND